# Altium schematic sheet 7-BOARD_EDGE_FINGERS.SchDoc
size B
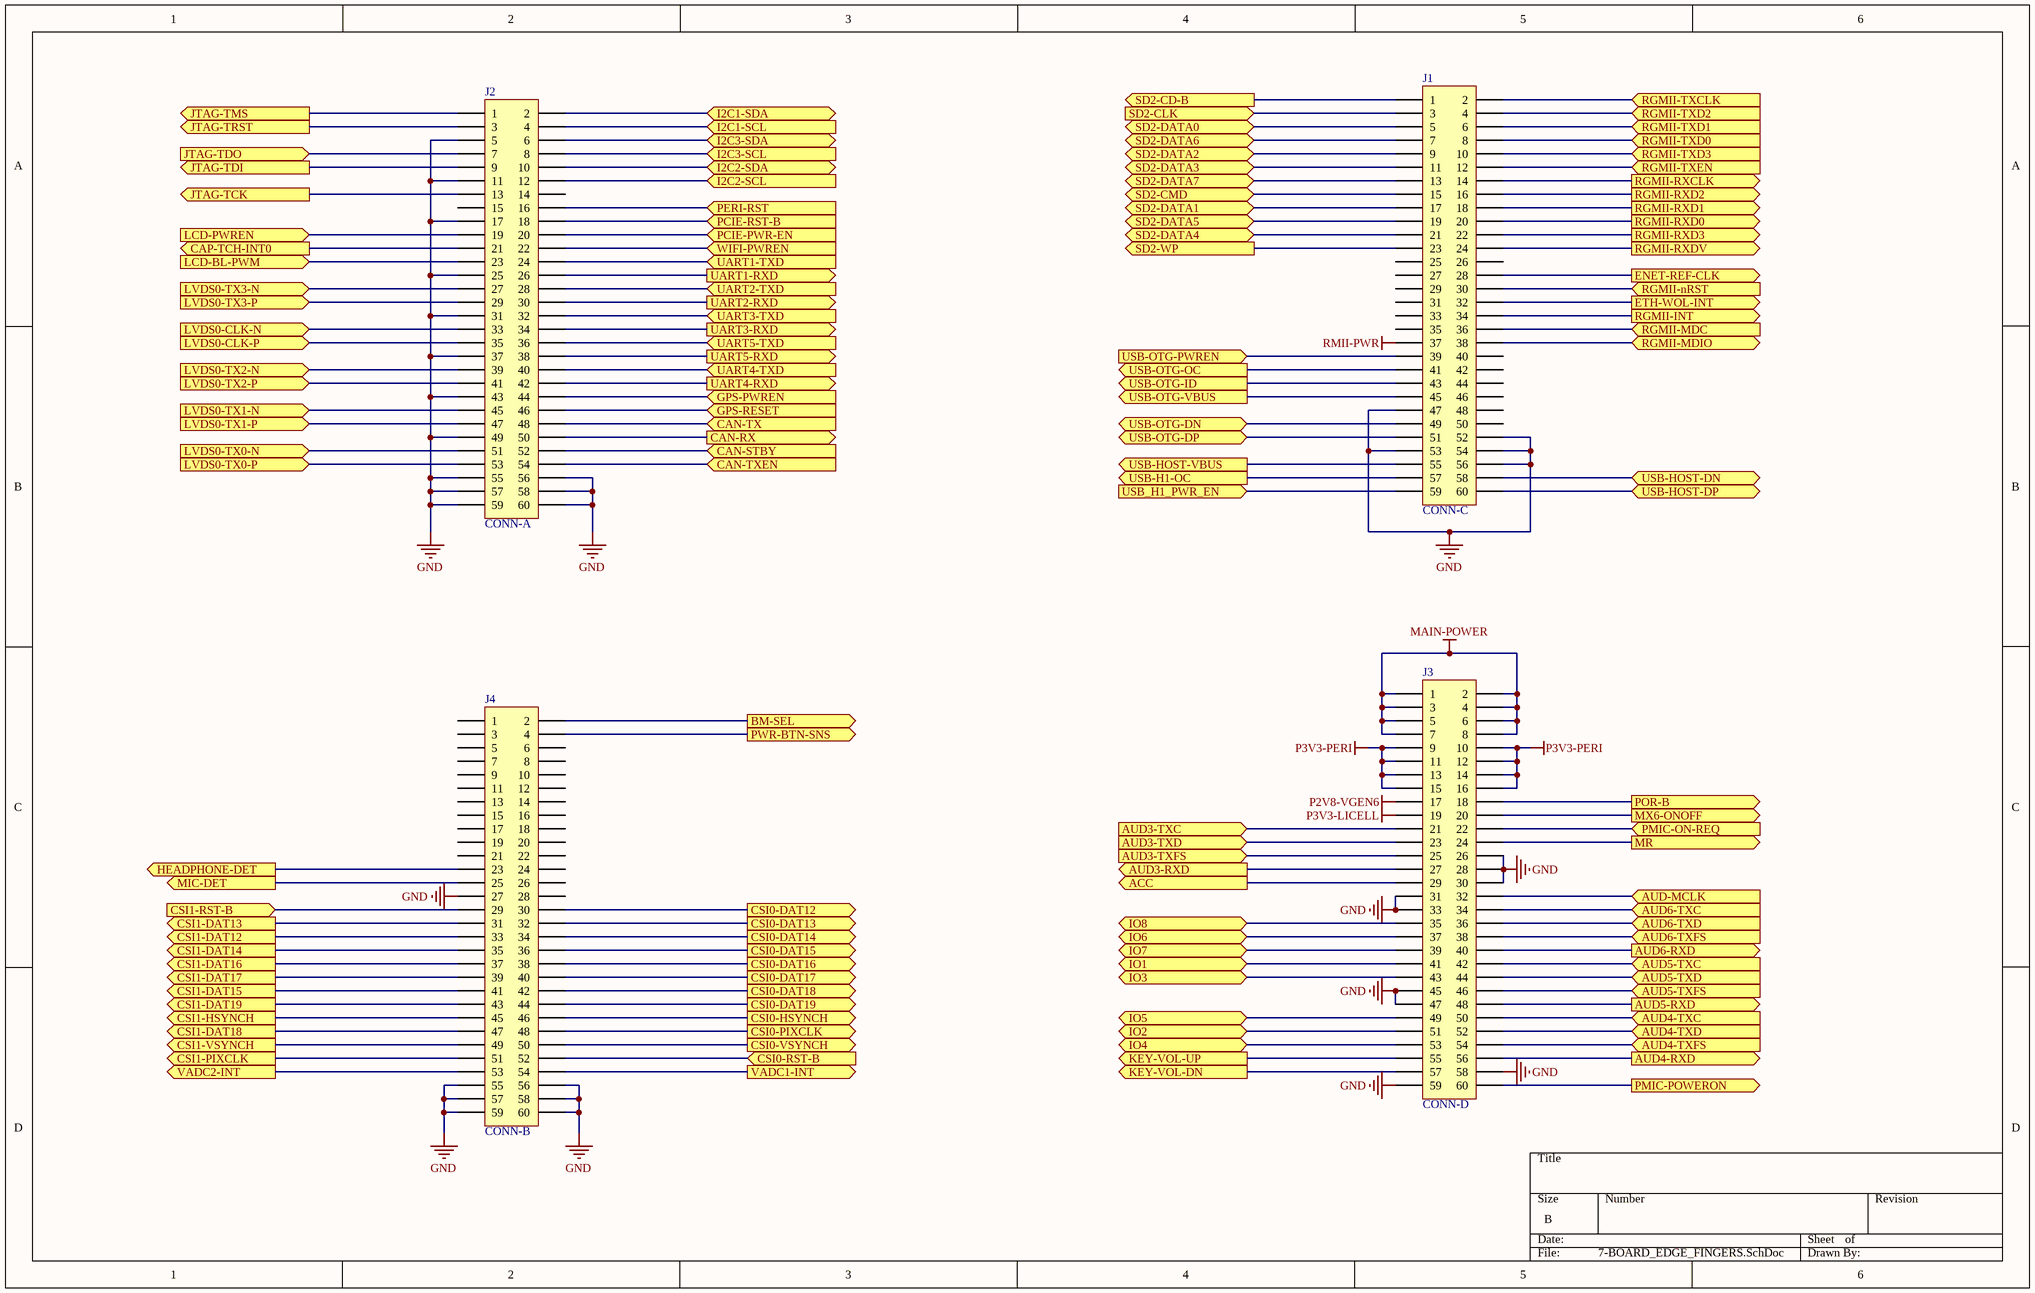
[diagram p0: 7-BOARD_EDGE_FINGERS.SchDoc]

## Parts
J1  CONN-C  [BTB0.5-M-60P]
J2  CONN-A  [BTB0.5-M-60P]
J3  CONN-D  [BTB0.5-M-60P]
J4  CONN-B  [BTB0.5-M-60P]

## Ports
ACC (out), AUD3-RXD (out), AUD3-TXC (in), AUD3-TXD (in), AUD3-TXFS (in), AUD4-RXD (out), AUD4-TXC (in), AUD4-TXD (in), AUD4-TXFS (in), AUD5-RXD (out), AUD5-TXC (in), AUD5-TXD (in), AUD5-TXFS (in), AUD6-RXD (out), AUD6-TXC (in), AUD6-TXD (in), AUD6-TXFS (in), AUD-MCLK (in), BM-SEL (out), CAN-RX (out), CAN-STBY (in), CAN-TX (in), CAN-TXEN (in), CAP-TCH-INT0 (out), CSI0-DAT12 (out), CSI0-DAT13 (out), CSI0-DAT14 (out), CSI0-DAT15 (out), CSI0-DAT16 (out), CSI0-DAT17 (out), CSI0-DAT18 (out), CSI0-DAT19 (out), CSI0-HSYNCH (out), CSI0-PIXCLK (out), CSI0-RST-B (in), CSI0-VSYNCH (out), CSI1-DAT12 (out), CSI1-DAT13 (out), CSI1-DAT14 (out), CSI1-DAT15 (out), CSI1-DAT16 (out), CSI1-DAT17 (out), CSI1-DAT18 (out), CSI1-DAT19 (out), CSI1-HSYNCH (out), CSI1-PIXCLK (out), CSI1-RST-B (in), CSI1-VSYNCH (out), ENET-REF-CLK (out), ETH-WOL-INT (out), GPS-PWREN (in), GPS-RESET (in), HEADPHONE-DET (out), I2C1-SCL (in), I2C1-SDA (bidir), I2C2-SCL (in), I2C2-SDA (bidir), I2C3-SCL (in), I2C3-SDA (bidir), IO1 (bidir), IO2 (bidir), IO3 (bidir), IO4 (bidir), IO5 (bidir), IO6 (bidir), IO7 (bidir), IO8 (bidir), JTAG-TCK (out), JTAG-TDI (out), JTAG-TDO (in), JTAG-TMS (out), JTAG-TRST (out), KEY-VOL-DN (out), KEY-VOL-UP (out), LCD-BL-PWM (in), LCD-PWREN (in), LVDS0-CLK-N (in), LVDS0-CLK-P (in), LVDS0-TX0-N (in), LVDS0-TX0-P (in), LVDS0-TX1-N (in), LVDS0-TX1-P (in), LVDS0-TX2-N (in), LVDS0-TX2-P (in), LVDS0-TX3-N (in), LVDS0-TX3-P (in), MIC-DET (out), MR (out), MX6-ONOFF (out), PCIE-PWR-EN (in), PCIE-RST-B (in), PERI-RST (in), PMIC-ON-REQ (in), PMIC-POWERON (out), POR-B (out), PWR-BTN-SNS (out), RGMII-INT (out), RGMII-MDC (in), RGMII-MDIO (bidir), RGMII-nRST (in), RGMII-RXCLK (out), RGMII-RXD0 (out), RGMII-RXD1 (out), RGMII-RXD2 (out), RGMII-RXD3 (out), RGMII-RXDV (out), RGMII-TXCLK (in), RGMII-TXD0 (in), RGMII-TXD1 (in), RGMII-TXD2 (in), RGMII-TXD3 (in), RGMII-TXEN (in), SD2-CD-B (out), SD2-CLK (in), SD2-CMD (bidir), SD2-DATA0 (bidir), SD2-DATA1 (bidir), SD2-DATA2 (bidir), SD2-DATA3 (bidir), SD2-DATA4 (bidir), SD2-DATA5 (bidir), SD2-DATA6 (bidir), SD2-DATA7 (bidir), SD2-WP (out), UART1-RXD (out), UART1-TXD (in), UART2-RXD (out), UART2-TXD (in), UART3-RXD (out), UART3-TXD (in), UART4-RXD (out), UART4-TXD (in), UART5-RXD (out), UART5-TXD (in), USB-H1-OC (out), USB-HOST-DN (bidir), USB-HOST-DP (bidir), USB-HOST-VBUS (out), USB-OTG-DN (bidir), USB-OTG-DP (bidir), USB-OTG-ID (out), USB-OTG-OC (out), USB-OTG-PWREN (in), USB-OTG-VBUS (out), USB_H1_PWR_EN (in), VADC1-INT (out), VADC2-INT (out), WIFI-PWREN (in)

## Nets
GND: J1.47 J1.52 J1.53 J1.54 J1.56 J2.5 J2.11 J2.17 J2.25 J2.31 J2.37 J2.43 J2.49 J2.55 J2.56 J2.57 J2.58 J2.59 J2.60 J3.26 J3.28 J3.30 J3.31 J3.33 J3.45 J3.47 J3.58 J3.59 J4.27 J4.55 J4.56 J4.57 J4.58 J4.59 J4.60
MAIN-POWER: J3.1 J3.2 J3.3 J3.4 J3.5 J3.6 J3.7 J3.8
P2V8-VGEN6: J3.17
P3V3-LICELL: J3.19
P3V3-PERI: J3.9 J3.10 J3.11 J3.12 J3.13 J3.14 J3.15 J3.16
RMII-PWR: J1.37
ACC: J3.29 ; port ACC
AUD3-RXD: J3.27 ; port AUD3-RXD
AUD3-TXC: J3.21 ; port AUD3-TXC
AUD3-TXD: J3.23 ; port AUD3-TXD
AUD3-TXFS: J3.25 ; port AUD3-TXFS
AUD4-RXD: J3.56 ; port AUD4-RXD
AUD4-TXC: J3.50 ; port AUD4-TXC
AUD4-TXD: J3.52 ; port AUD4-TXD
AUD4-TXFS: J3.54 ; port AUD4-TXFS
AUD5-RXD: J3.48 ; port AUD5-RXD
AUD5-TXC: J3.42 ; port AUD5-TXC
AUD5-TXD: J3.44 ; port AUD5-TXD
AUD5-TXFS: J3.46 ; port AUD5-TXFS
AUD6-RXD: J3.40 ; port AUD6-RXD
AUD6-TXC: J3.34 ; port AUD6-TXC
AUD6-TXD: J3.36 ; port AUD6-TXD
AUD6-TXFS: J3.38 ; port AUD6-TXFS
AUD-MCLK: J3.32 ; port AUD-MCLK
BM-SEL: J4.2 ; port BM-SEL
CAN-RX: J2.50 ; port CAN-RX
CAN-STBY: J2.52 ; port CAN-STBY
CAN-TX: J2.48 ; port CAN-TX
CAN-TXEN: J2.54 ; port CAN-TXEN
CAP-TCH-INT0: J2.21 ; port CAP-TCH-INT0
CSI0-DAT12: J4.30 ; port CSI0-DAT12
CSI0-DAT13: J4.32 ; port CSI0-DAT13
CSI0-DAT14: J4.34 ; port CSI0-DAT14
CSI0-DAT15: J4.36 ; port CSI0-DAT15
CSI0-DAT16: J4.38 ; port CSI0-DAT16
CSI0-DAT17: J4.40 ; port CSI0-DAT17
CSI0-DAT18: J4.42 ; port CSI0-DAT18
CSI0-DAT19: J4.44 ; port CSI0-DAT19
CSI0-HSYNCH: J4.46 ; port CSI0-HSYNCH
CSI0-PIXCLK: J4.48 ; port CSI0-PIXCLK
CSI0-RST-B: J4.52 ; port CSI0-RST-B
CSI0-VSYNCH: J4.50 ; port CSI0-VSYNCH
CSI1-DAT12: J4.33 ; port CSI1-DAT12
CSI1-DAT13: J4.31 ; port CSI1-DAT13
CSI1-DAT14: J4.35 ; port CSI1-DAT14
CSI1-DAT15: J4.41 ; port CSI1-DAT15
CSI1-DAT16: J4.37 ; port CSI1-DAT16
CSI1-DAT17: J4.39 ; port CSI1-DAT17
CSI1-DAT18: J4.47 ; port CSI1-DAT18
CSI1-DAT19: J4.43 ; port CSI1-DAT19
CSI1-HSYNCH: J4.45 ; port CSI1-HSYNCH
CSI1-PIXCLK: J4.51 ; port CSI1-PIXCLK
CSI1-RST-B: J4.29 ; port CSI1-RST-B
CSI1-VSYNCH: J4.49 ; port CSI1-VSYNCH
ENET-REF-CLK: J1.28 ; port ENET-REF-CLK
ETH-WOL-INT: J1.32 ; port ETH-WOL-INT
GPS-PWREN: J2.44 ; port GPS-PWREN
GPS-RESET: J2.46 ; port GPS-RESET
HEADPHONE-DET: J4.23 ; port HEADPHONE-DET
I2C1-SCL: J2.4 ; port I2C1-SCL
I2C1-SDA: J2.2 ; port I2C1-SDA
I2C2-SCL: J2.12 ; port I2C2-SCL
I2C2-SDA: J2.10 ; port I2C2-SDA
I2C3-SCL: J2.8 ; port I2C3-SCL
I2C3-SDA: J2.6 ; port I2C3-SDA
IO1: J3.41 ; port IO1
IO2: J3.51 ; port IO2
IO3: J3.43 ; port IO3
IO4: J3.53 ; port IO4
IO5: J3.49 ; port IO5
IO6: J3.37 ; port IO6
IO7: J3.39 ; port IO7
IO8: J3.35 ; port IO8
JTAG-TCK: J2.13 ; port JTAG-TCK
JTAG-TDI: J2.9 ; port JTAG-TDI
JTAG-TDO: J2.7 ; port JTAG-TDO
JTAG-TMS: J2.1 ; port JTAG-TMS
JTAG-TRST: J2.3 ; port JTAG-TRST
KEY-VOL-DN: J3.57 ; port KEY-VOL-DN
KEY-VOL-UP: J3.55 ; port KEY-VOL-UP
LCD-BL-PWM: J2.23 ; port LCD-BL-PWM
LCD-PWREN: J2.19 ; port LCD-PWREN
LVDS0-CLK-N: J2.33 ; port LVDS0-CLK-N
LVDS0-CLK-P: J2.35 ; port LVDS0-CLK-P
LVDS0-TX0-N: J2.51 ; port LVDS0-TX0-N
LVDS0-TX0-P: J2.53 ; port LVDS0-TX0-P
LVDS0-TX1-N: J2.45 ; port LVDS0-TX1-N
LVDS0-TX1-P: J2.47 ; port LVDS0-TX1-P
LVDS0-TX2-N: J2.39 ; port LVDS0-TX2-N
LVDS0-TX2-P: J2.41 ; port LVDS0-TX2-P
LVDS0-TX3-N: J2.27 ; port LVDS0-TX3-N
LVDS0-TX3-P: J2.29 ; port LVDS0-TX3-P
MIC-DET: J4.25 ; port MIC-DET
MR: J3.24 ; port MR
MX6-ONOFF: J3.20 ; port MX6-ONOFF
PCIE-PWR-EN: J2.20 ; port PCIE-PWR-EN
PCIE-RST-B: J2.18 ; port PCIE-RST-B
PERI-RST: J2.16 ; port PERI-RST
PMIC-ON-REQ: J3.22 ; port PMIC-ON-REQ
PMIC-POWERON: J3.60 ; port PMIC-POWERON
POR-B: J3.18 ; port POR-B
PWR-BTN-SNS: J4.4 ; port PWR-BTN-SNS
RGMII-INT: J1.34 ; port RGMII-INT
RGMII-MDC: J1.36 ; port RGMII-MDC
RGMII-MDIO: J1.38 ; port RGMII-MDIO
RGMII-nRST: J1.30 ; port RGMII-nRST
RGMII-RXCLK: J1.14 ; port RGMII-RXCLK
RGMII-RXD0: J1.20 ; port RGMII-RXD0
RGMII-RXD1: J1.18 ; port RGMII-RXD1
RGMII-RXD2: J1.16 ; port RGMII-RXD2
RGMII-RXD3: J1.22 ; port RGMII-RXD3
RGMII-RXDV: J1.24 ; port RGMII-RXDV
RGMII-TXCLK: J1.2 ; port RGMII-TXCLK
RGMII-TXD0: J1.8 ; port RGMII-TXD0
RGMII-TXD1: J1.6 ; port RGMII-TXD1
RGMII-TXD2: J1.4 ; port RGMII-TXD2
RGMII-TXD3: J1.10 ; port RGMII-TXD3
RGMII-TXEN: J1.12 ; port RGMII-TXEN
SD2-CD-B: J1.1 ; port SD2-CD-B
SD2-CLK: J1.3 ; port SD2-CLK
SD2-CMD: J1.15 ; port SD2-CMD
SD2-DATA0: J1.5 ; port SD2-DATA0
SD2-DATA1: J1.17 ; port SD2-DATA1
SD2-DATA2: J1.9 ; port SD2-DATA2
SD2-DATA3: J1.11 ; port SD2-DATA3
SD2-DATA4: J1.21 ; port SD2-DATA4
SD2-DATA5: J1.19 ; port SD2-DATA5
SD2-DATA6: J1.7 ; port SD2-DATA6
SD2-DATA7: J1.13 ; port SD2-DATA7
SD2-WP: J1.23 ; port SD2-WP
UART1-RXD: J2.26 ; port UART1-RXD
UART1-TXD: J2.24 ; port UART1-TXD
UART2-RXD: J2.30 ; port UART2-RXD
UART2-TXD: J2.28 ; port UART2-TXD
UART3-RXD: J2.34 ; port UART3-RXD
UART3-TXD: J2.32 ; port UART3-TXD
UART4-RXD: J2.42 ; port UART4-RXD
UART4-TXD: J2.40 ; port UART4-TXD
UART5-RXD: J2.38 ; port UART5-RXD
UART5-TXD: J2.36 ; port UART5-TXD
USB-H1-OC: J1.57 ; port USB-H1-OC
USB-HOST-DN: J1.58 ; port USB-HOST-DN
USB-HOST-DP: J1.60 ; port USB-HOST-DP
USB-HOST-VBUS: J1.55 ; port USB-HOST-VBUS
USB-OTG-DN: J1.49 ; port USB-OTG-DN
USB-OTG-DP: J1.51 ; port USB-OTG-DP
USB-OTG-ID: J1.43 ; port USB-OTG-ID
USB-OTG-OC: J1.41 ; port USB-OTG-OC
USB-OTG-PWREN: J1.39 ; port USB-OTG-PWREN
USB-OTG-VBUS: J1.45 ; port USB-OTG-VBUS
USB_H1_PWR_EN: J1.59 ; port USB_H1_PWR_EN
VADC1-INT: J4.54 ; port VADC1-INT
VADC2-INT: J4.53 ; port VADC2-INT
WIFI-PWREN: J2.22 ; port WIFI-PWREN

Not connected (* = marked no-connect by the designer): J1 25 26 27 29 31 33 35 40 42 44 46 48 50; J2 14 15; J4 1 3 5 6 7 8 9 10 11 12 13 14 15 16 17 18 19 20 21 22 24 26 28

## Library data of the parts
J1-J4 = Header 30X2: Header, 30-Pin, Dual row; LatestRevisionDate: 17-Jul-2002; LatestRevisionNote: Re-released for DXP Platform.; Publisher: Altium Limited